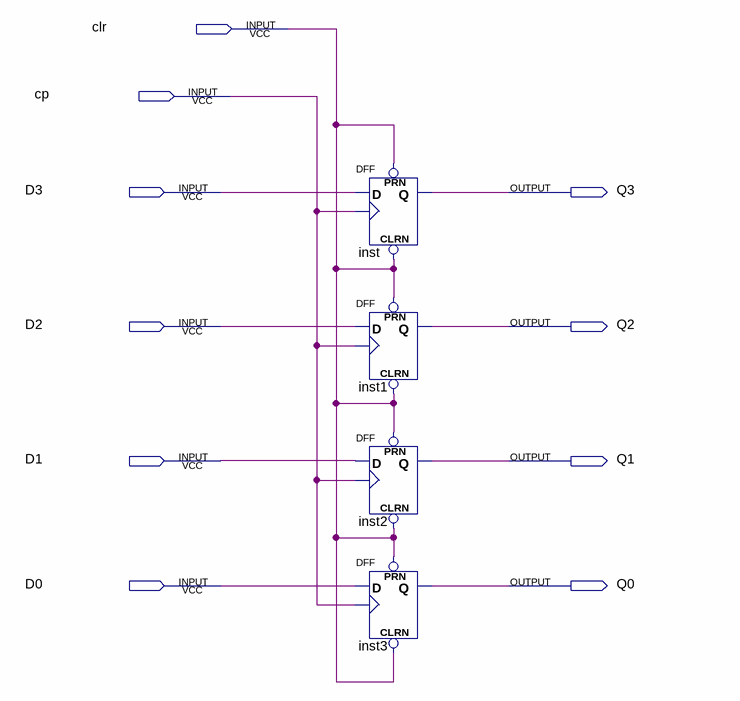
[diagram p0: schematic sheet]
// Quartus schematic register-4.bdf as structural Verilog: 4 symbols, 10 pins
module \register-4  (
  input  clr,
  input  cp,
  input  D3,
  input  D2,
  input  D1,
  input  D0,
  output Q3,
  output Q2,
  output Q1,
  output Q0
);

  DFF inst (.CLRN(clr), .CLK(cp), .D(D3), .PRN(clr), .Q(Q3));
  DFF inst1 (.CLRN(clr), .CLK(cp), .D(D2), .PRN(clr), .Q(Q2));
  DFF inst2 (.CLRN(clr), .CLK(cp), .D(D1), .PRN(clr), .Q(Q1));
  DFF inst3 (.CLRN(clr), .CLK(cp), .D(D0), .PRN(clr), .Q(Q0));
endmodule
